# EAGLE design attinier84-motherboard-mk-3.2 (EAGLE 6.5.0)
REVISION: 3.0
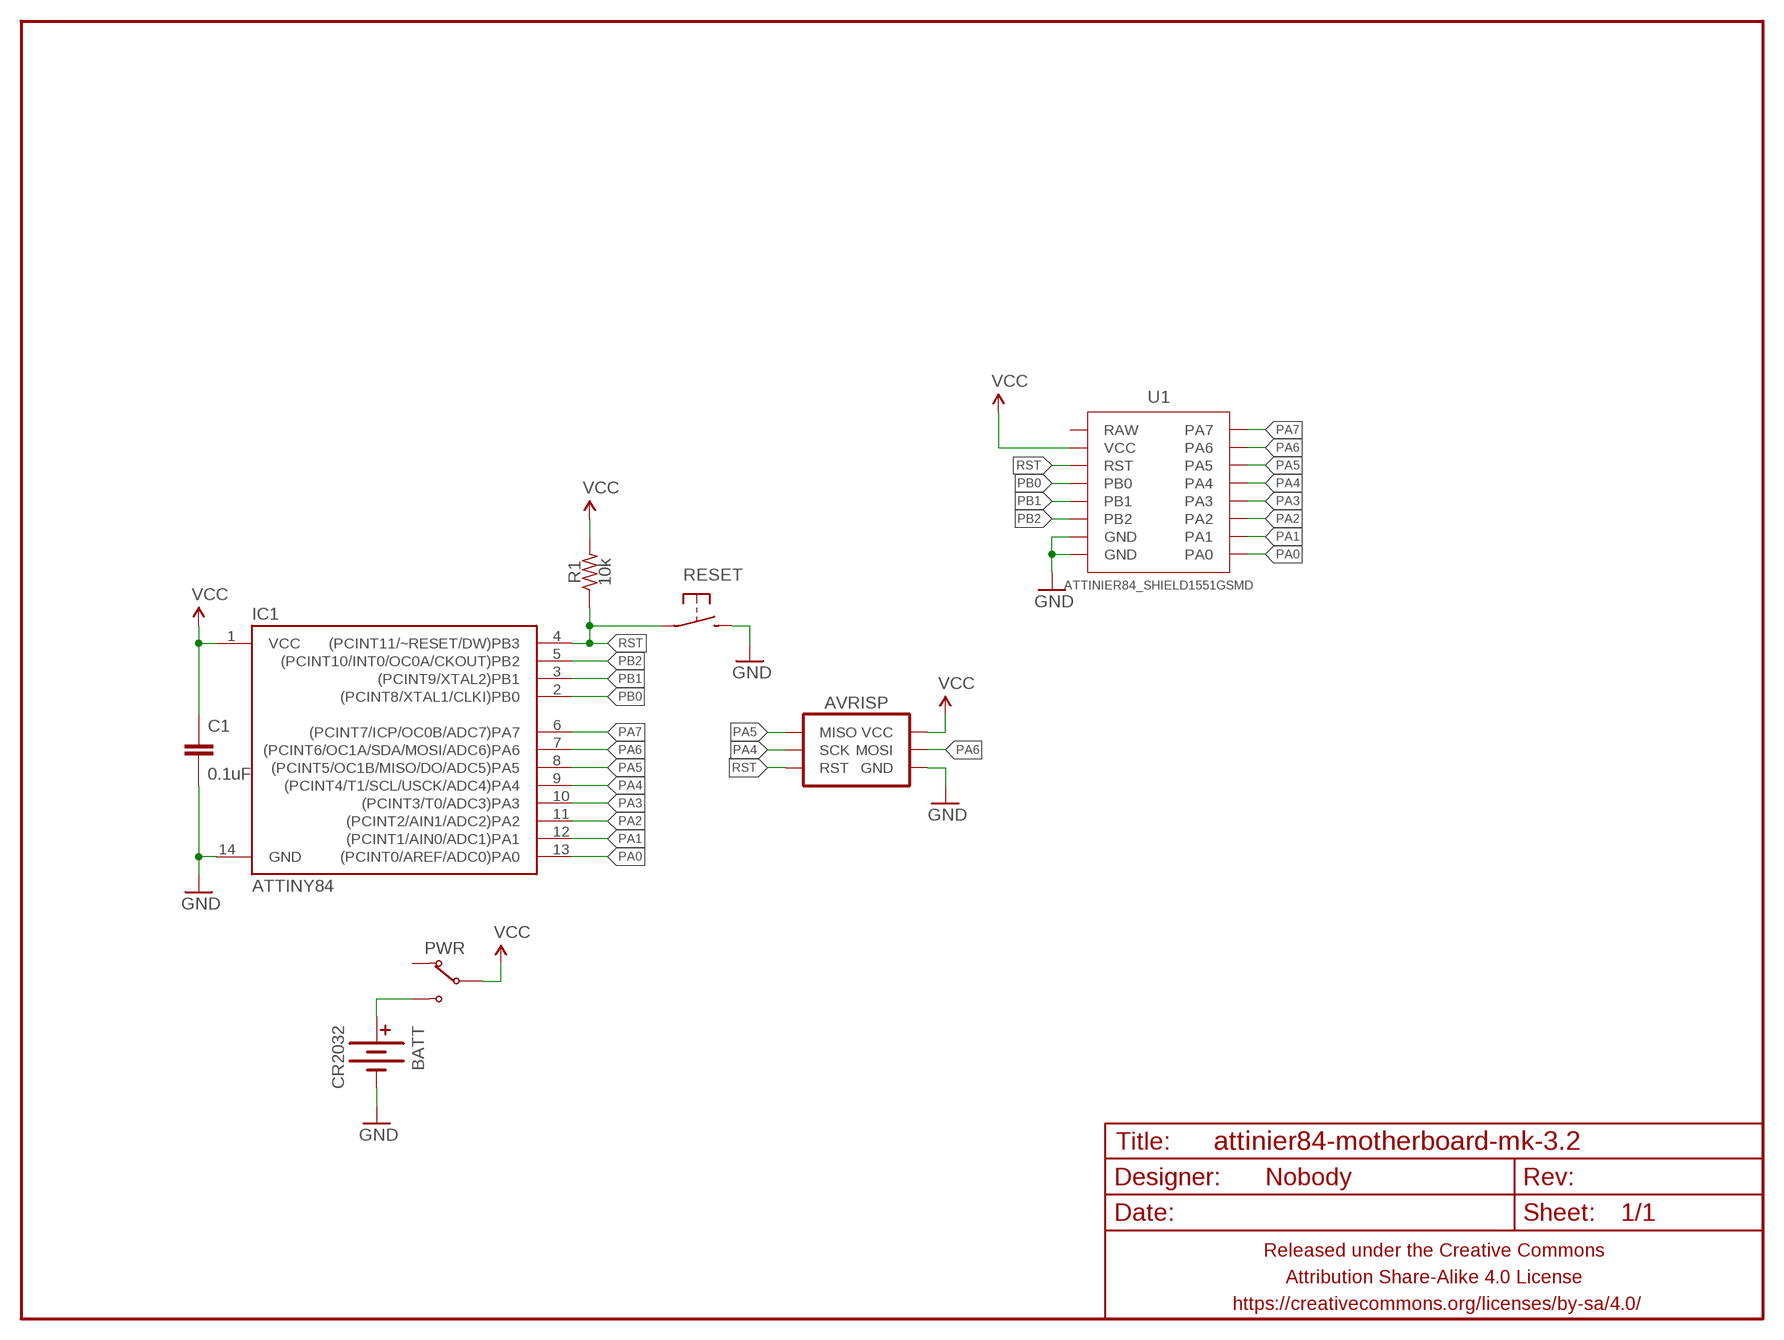
[diagram p0: schematic, sheet 1]

## Parts
AVRISP  AVR_SPI_PRG_6PTH  [2X3]
BATT  CR2032  BATTERY20PTH_TOPLOAD  [BATTCON_20MM_PTH_TOPLOAD]
C1  0.1uF  CAPACITOR-CERAMICC0805  [C0805]
FRAME1  FRAME-LETTERNO_PACKAGE  [DUMMY]
IC1  ATTINY84  [SO14]
PWR  SWITCH-SPDTPTH-RA-2.54MM  [SPDT-RA-2.54MM]
R1  10k  RESISTORR0805  [R0805]
RESET  SPST-NO-TACT3MM-RA  [TACTILE-PTH-SIDE]
U1  ATTINIER84_SHIELD1551GSMD  [ATTINIER84_SHIELD2_SMD]

## Nets
GND: AVRISP.6(GND) BATT.- C1.2 IC1.14(GND) RESET.2 U1.GND@1(GND) U1.GND@2(GND)
N$1: BATT.+ PWR.3(NO)
PA0: IC1.13((PCINT0/AREF/ADC0)PA0) U1.PA0
PA1: IC1.12((PCINT1/AIN0/ADC1)PA1) U1.PA1
PA2: IC1.11((PCINT2/AIN1/ADC2)PA2) U1.PA2
PA3: IC1.10((PCINT3/T0/ADC3)PA3) U1.PA3
PA4: AVRISP.3(SCK) IC1.9((PCINT4/T1/SCL/USCK/ADC4)PA4) U1.PA4
PA5: AVRISP.1(MISO) IC1.8((PCINT5/OC1B/MISO/DO/ADC5)PA5) U1.PA5
PA6: AVRISP.4(MOSI) IC1.7((PCINT6/OC1A/SDA/MOSI/ADC6)PA6) U1.PA6
PA7: IC1.6((PCINT7/ICP/OC0B/ADC7)PA7) U1.PA7
PB0: IC1.2((PCINT8/XTAL1/CLKI)PB0) U1.PB0
PB1: IC1.3((PCINT9/XTAL2)PB1) U1.PB1
PB2: IC1.5((PCINT10/INT0/OC0A/CKOUT)PB2) U1.PB2
RST: AVRISP.5(RST) IC1.4((PCINT11/~RESET/DW)PB3) R1.1 RESET.1 U1.RST
VCC: AVRISP.2(VCC) C1.1 IC1.1(VCC) PWR.2(COM) R1.2 U1.VCC
Unconnected: PWR.1(NC) U1.RAW

## Library data of the parts
AVRISP = A_butts:AVR_SPI_PRG_6: AVR ISP 6 Pin This is the reduced ISP connector for AVR programming. Common on Arduino. This footprint will take up less PCB space and can be used with a 10-pin to 6-pin adapter such as SKU: BOB-08508 **Special note about "TEST_POINT" package. The stop mask is on the top side, so if you want your programming test points to be on the bottom of your board, make sure to place this package on the bottom side of the board. This also ensure that the orientation to program from the bottom side will be correct.
BATT = A_butts:BATTERY: Battery Holders Various common sizes : AA, AAA, 20mm coin cell and 12mm coin cell. 20MM_4LEGS, BATT-10373
C1 = A_butts:CAPACITOR-CERAMIC: CAPACITOR, European symbol
FRAME1 = A_butts:FRAME-LETTER: Schematic Frame Standard 8.5x11 US Letter frame; DESIGNER: Nobody
IC1 = A_butts:ATTINY84: Atmel 14-pin 2/4/8kB flash uC
PWR = A_butts:SWITCH-SPDT
R1 = A_butts:RESISTOR: RESISTOR, American symbol
RESET = A_butts:SPST-NO-TACT
U1 = A_butts:ATTINIER84_SHIELD

## Board
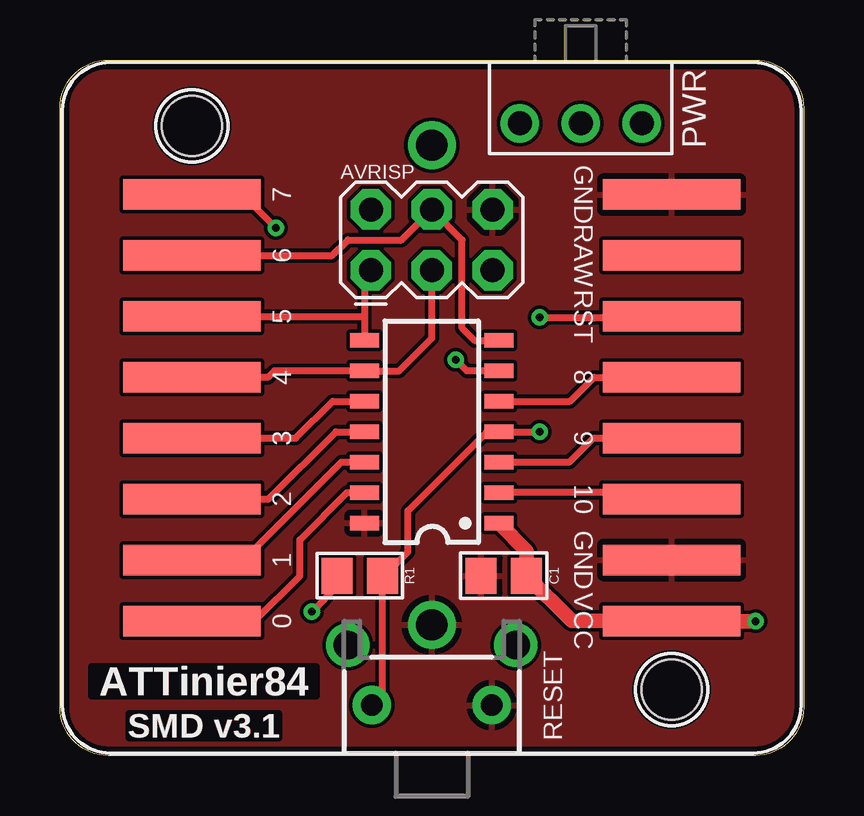
[diagram p1: board, top side]
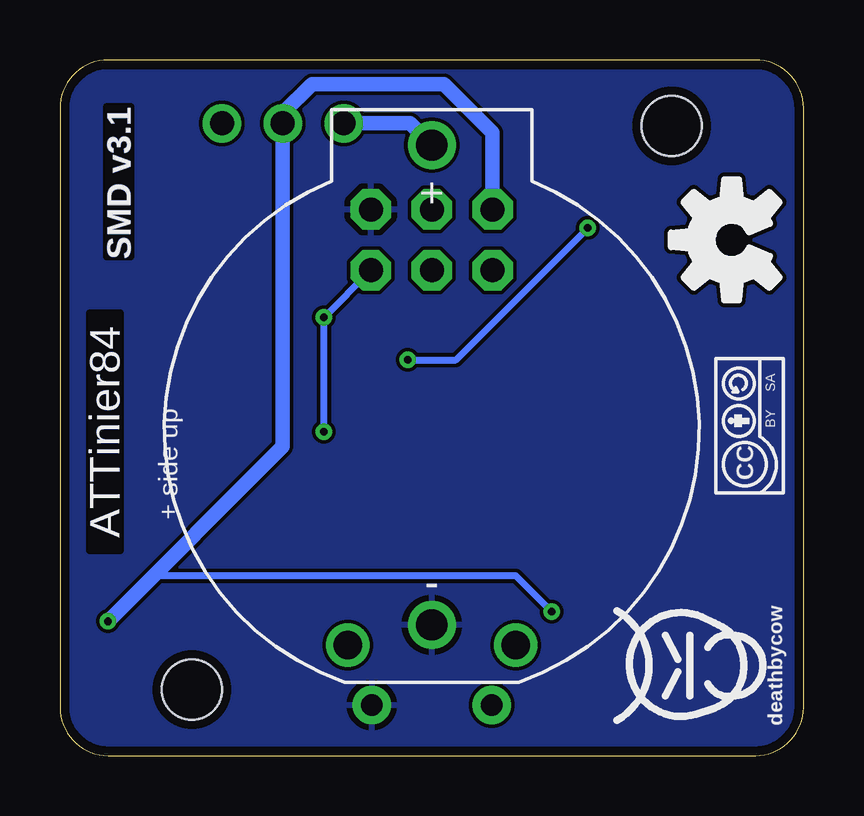
[diagram p2: board, bottom side, seen from below]

Size 31 x 29 mm. Coordinates in mm from the lower left corner, seen from the top.
Copper layers (1*16): Top 0.0356mm / dielectric 1.5011mm / Bottom 0.0356mm
Design rules "LaenPCBOrder_2": minimum track width 6mil, minimum drill 13mil, track to track 6mil, track to pad 6mil, pad to pad 6mil, via to via 6mil, smd to smd 6mil, copper to edge 15mil, drill to drill 6mil, minimum pad ring 7mil, minimum via ring 7mil, stop-mask expansion 3mil, vias tented up to drill 20mil, thermal gap 10mil

### Footprints (pad centres in the part's own frame; a part is rotated, then mirrored left to right if it is on the bottom)
2X3 = drill 1 pad 1.676 octagon: 1 -2.54,-1.27; 2 -2.54,1.27; 3 0,-1.27; 4 0,1.27; 5 2.54,-1.27; 6 2.54,1.27
BATTCON_20MM_PTH_TOPLOAD = drill 1.3 pad 2: + 11.85,0; - -8.15,0
C0805 = smd 1.3 x 1.5: 1 -0.95,0; 2 0.95,0
SO14 = smd 0.6 x 1.2: 1 -3.81,-2.8; 2 -2.54,-2.8; 3 -1.27,-2.8; 4 0,-2.8; 5 1.27,-2.8; 6 2.54,-2.8; 7 3.81,-2.8; 8 3.81,2.8; 9 2.54,2.8; 10 1.27,2.8; 11 0,2.8; 12 -1.27,2.8; 13 -2.54,2.8; 14 -3.81,2.8
SPDT-RA-2.54MM = drill 1 pad 1.6: 1 0,0; 2 2.54,0; 3 5.08,0
R0805 = smd 1.3 x 1.5: 1 -0.95,0; 2 0.95,0
TACTILE-PTH-SIDE = drill 0.9 pad 1.6: 1 -2.5,0; 2 2.5,0 | drill 1.2: ANCHOR1 -3.5,2.5; ANCHOR2 3.5,2.5
ATTINIER84_SHIELD2_SMD = smd 5.715 x 1.27: GND@1 10,8.89; GND@2 10,-6.35; PA0 -10,-8.89; PA1 -10,-6.35; PA2 -10,-3.81; PA3 -10,-1.27; PA4 -10,1.27; PA5 -10,3.81; PA6 -10,6.35; PA7 -10,8.89; PB0 10,-3.81; PB1 10,-1.27; PB2 10,1.27; RAW 10,6.35; RST 10,3.81; VCC 10,-8.89 | hole 2.5: -10,11.75; 10,-11.75

### Placement (x,y rotation side)
AVRISP  15.5,21.5 0 top
BATT  15.5,13.6 90 bottom
C1  18.5,7.5 180 top
FRAME1  0,0 0 top
IC1  15.5,13.5 90 top
PWR  24.25,26.36 180 top
R1  12.5,7.5 180 top
RESET  15.5,2.1 0 top
U1  15.5,14.5 0 top
U$1  [CC-BY-SA-4.0-NO-URL]  2.25,13.75 90 bottom
U$2  [COW_SMALL]  5.25,3.75 90 bottom
U$4  [OSHWLOGO_BOT_0.2_A]  3,21.5 270 top

### Tracks (layer width: path | path; a pad name or v marks a point on that pad's centre or on a via)
GND
  pour Bottom: -0.1,-0.1 -0.1,29.1 31.1,29.1 31.1,-0.1
  pour Top: -0.1,-0.1 -0.1,29.1 31.1,29.1 31.1,-0.1
N$1
  Bottom 0.6: BATT.+ 16.41,26.36 PWR.3
PA0
  Top 0.3: U1.PA0 8.11,5.61 10,7.5 10,9 11.96,10.96 IC1.13
PA1
  Top 0.3: U1.PA1 7.65,8.15 11.73,12.23 IC1.12
PA2
  Top 0.3: U1.PA2 8.69,10.69 11.5,13.5 IC1.11
PA3
  Top 0.3: U1.PA3 9.83,13.23 11.37,14.77 IC1.10
PA4
  Top 0.3: U1.PA4 8.67,15.77 8.94,16.04 IC1.9 14.14,16.04 15.5,17.4 AVRISP.3
PA5
  Top 0.3: AVRISP.1 12.7,19.97 12.7,18.31 | IC1.8 12.7,17.7 12.7,18.31 | U1.PA5 12.7,18.31
PA6
  Top 0.3: U1.PA6 11.35,20.85 12,21.5 14.23,21.5 AVRISP.4 16.77,21.5 16.77,17.83 17.29,17.31 IC1.7
PA7  (via drill 0.33)
  Top 0.3: IC1.6 16.96,16.04 v16.5,16.5 | v9,22 7.61,23.39 U1.PA7
  Bottom 0.3: v16.5,16.5 14.5,16.5 v9,22
PB0
  Top 0.3: U1.PB0 25.27,10.46 24.77,10.96 IC1.2
PB1
  Top 0.3: IC1.3 21.23,12.23 22.23,13.23 U1.PB1
PB2
  Top 0.3: IC1.5 21.27,14.77 22.27,15.77 U1.PB2
RST  (via drill 0.33)
  Top 0.3: RESET.1 13.45,2.55 R1.1 13.5,7.5 14.5,8.5 14.5,10.2 17.8,13.5 IC1.4 v20,13.5 | v20,18.27 25.46,18.27 U1.RST
  Bottom 0.3: AVRISP.5 v20,18.27 v20,13.5
VCC  (via drill 0.33)
  Top 0.3: R1.2 11.55,7.05 v10.5,6
  Top 0.6: v29,5.6 U1.VCC 21.34,5.61 C1.1 19.45,8.54 IC1.1
  Bottom 0.3: v10.5,6 12,7.5 27.1,7.5 v29,5.6
  Bottom 0.6: AVRISP.2 12.96,25.96 15,28 20.5,28 21.71,26.79 PWR.2 21.71,12.89 v29,5.6

### Text on the board
Top: ATTinier84
Bottom: ATTinier84
tPlace: ATTinier84
bPlace: ATTinier84 | + side up